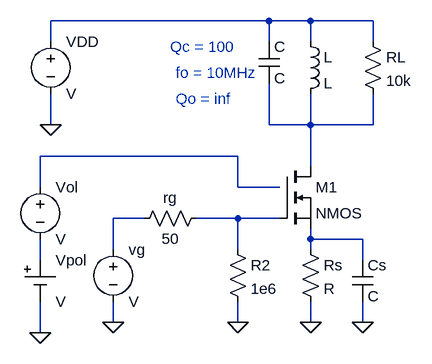
[diagram p0: schematic Draft2.asc]
Draft2.asc, the LTspice schematic file:
Version 4
SHEET 1 880 680
WIRE 32 -80 -304 -80
WIRE 96 -80 32 -80
WIRE 192 -80 96 -80
WIRE -304 -48 -304 -80
WIRE 32 -48 32 -80
WIRE 96 -48 96 -80
WIRE 192 -48 192 -80
WIRE -304 80 -304 32
WIRE 32 80 32 16
WIRE 96 80 96 32
WIRE 96 80 32 80
WIRE 192 80 192 32
WIRE 192 80 96 80
WIRE -16 128 -320 128
WIRE 96 144 96 80
WIRE -320 176 -320 128
WIRE -16 176 -16 128
WIRE 48 176 -16 176
WIRE -160 224 -208 224
WIRE -16 224 -80 224
WIRE 48 224 -16 224
WIRE 96 256 96 240
WIRE 176 256 96 256
WIRE -208 272 -208 224
WIRE -16 272 -16 224
WIRE 96 272 96 256
WIRE -320 288 -320 256
WIRE 176 288 176 256
WIRE -208 384 -208 352
WIRE -16 384 -16 352
WIRE 96 384 96 352
WIRE 176 384 176 352
WIRE -320 400 -320 352
FLAG 96 384 0
FLAG 176 384 0
FLAG -16 384 0
FLAG -208 384 0
FLAG -320 400 0
FLAG -304 80 0
SYMBOL nmos 48 144 R0
SYMATTR InstName M1
SYMBOL res 80 256 R0
SYMATTR InstName Rs
SYMBOL cap 160 288 R0
SYMATTR InstName Cs
SYMBOL res -32 256 R0
SYMATTR InstName R2
SYMATTR Value 1e6
SYMBOL res -64 208 R90
WINDOW 0 0 56 VBottom 2
WINDOW 3 32 56 VTop 2
SYMATTR InstName rg
SYMATTR Value 50
SYMBOL voltage -208 256 R0
SYMATTR InstName vg
SYMBOL voltage -320 160 R0
SYMATTR InstName Vol
SYMBOL Misc\\cell -320 288 R0
SYMATTR InstName Vpol
SYMBOL res 176 -64 R0
SYMATTR InstName RL
SYMATTR Value 10k
SYMBOL ind 80 -64 R0
SYMATTR InstName L
SYMBOL cap 16 -48 R0
SYMATTR InstName C
SYMBOL voltage -304 -64 R0
SYMATTR InstName VDD
TEXT -120 -40 Left 2 ;Qc = 100
TEXT -112 0 Left 2 ;fo = 10MHz
TEXT -112 40 Left 2 ;Qo = inf

The netlist it stands for:
* Draft2.asc
M1 N002 N005 N006 N006 NMOS
Rs N006 0 R
Cs N006 0 C
R2 N005 0 1e6
rg N005 N004 50
vg N004 0 V
Vol N003 N007 V
Vpol N007 0 V
RL N001 N002 10k
L N001 N002 L
C N001 N002 C
VDD N001 0 V
.model NMOS NMOS
.model PMOS PMOS
.lib standard.mos
* Qc = 100
* fo = 10MHz
* Qo = inf
.backanno
.end